# EAGLE design db9breakout (EAGLE 7.7.0)
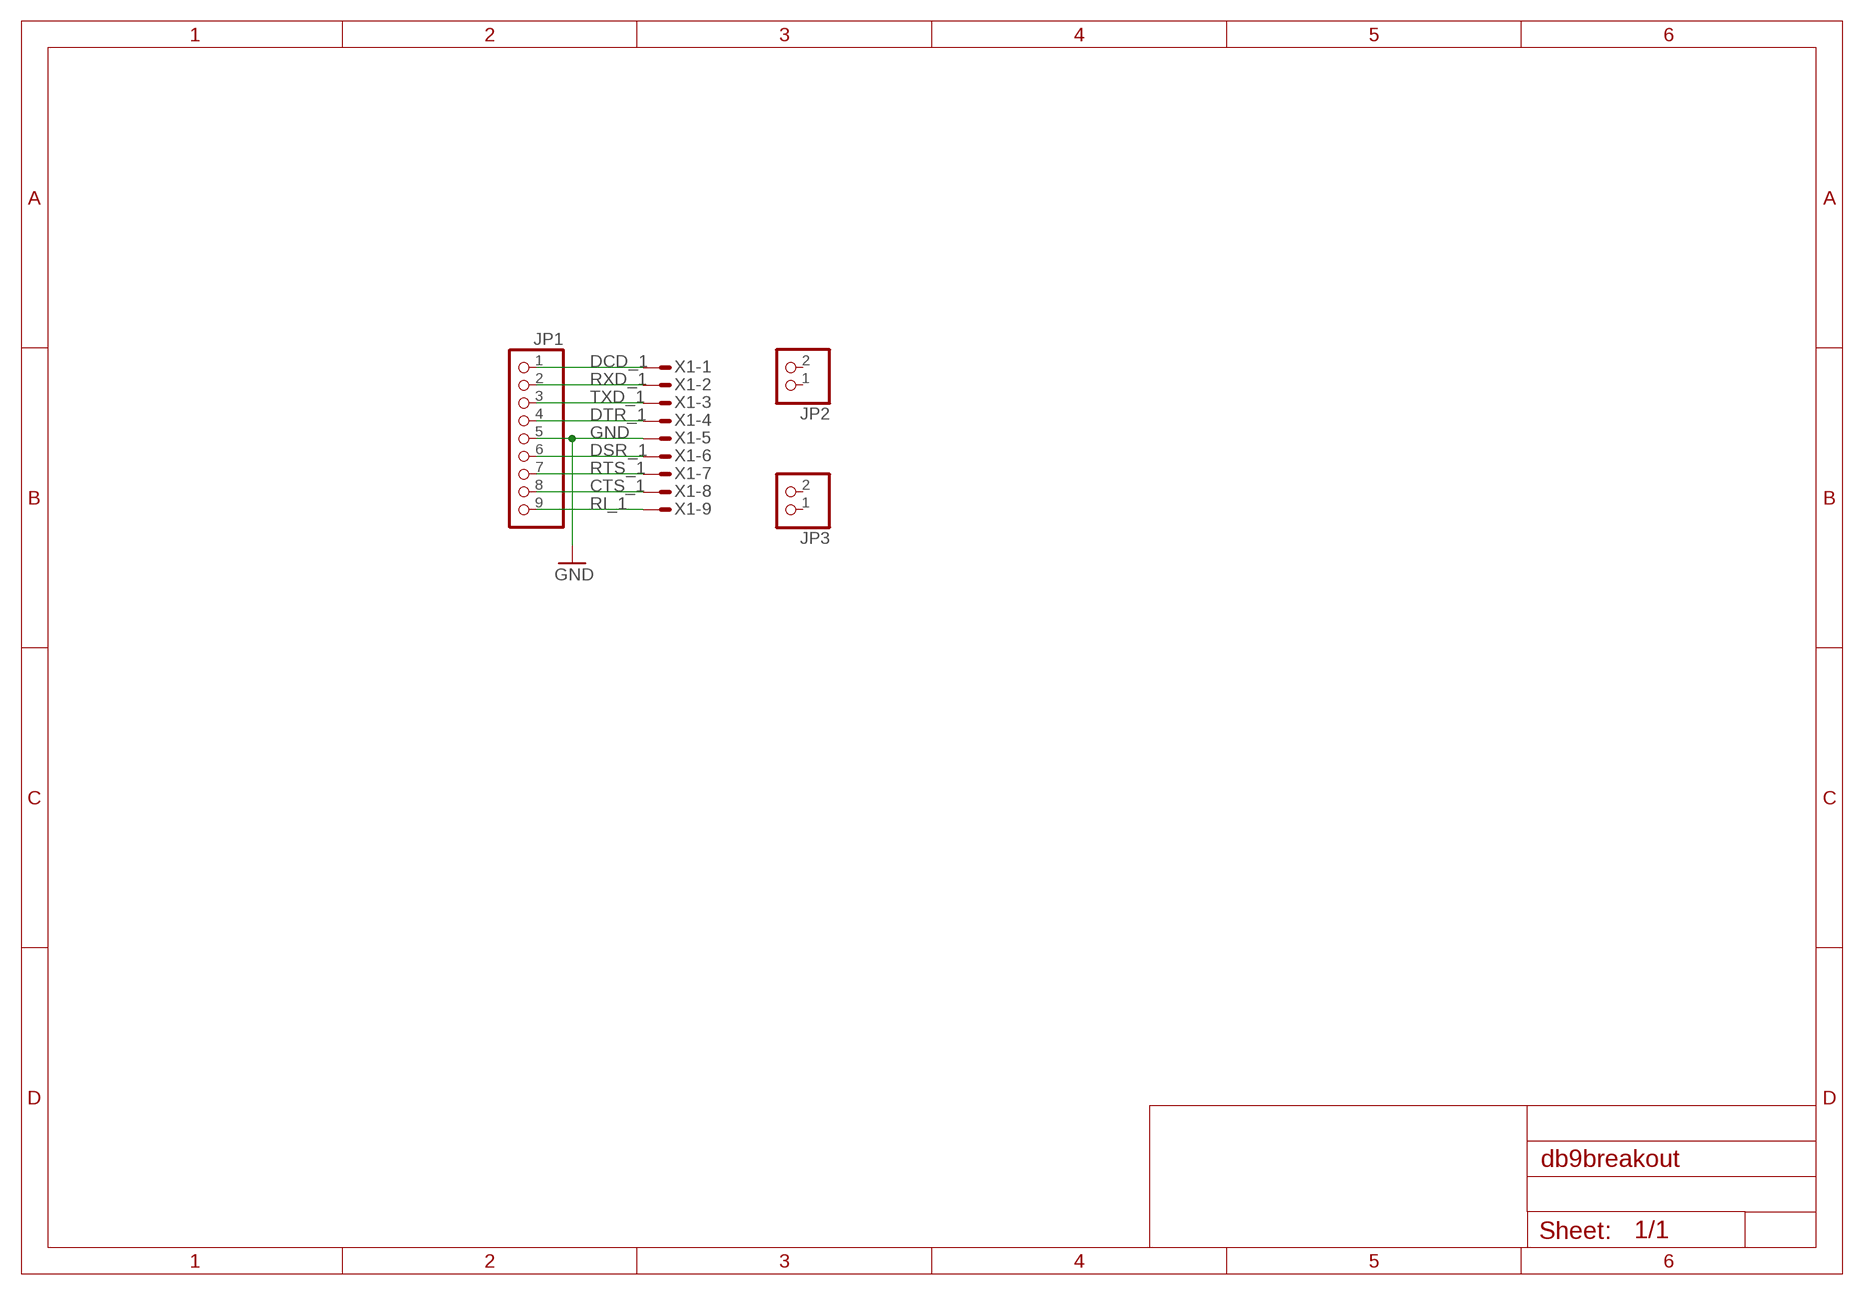
[diagram p0: schematic, sheet 1]

## Parts
JP1  PINHD-1X9  [1X09]
JP2  PINHD-1X2  [1X02]
JP3  PINHD-1X2  [1X02]
X1  M09HPS  [M09HP]

## Nets
CTS_1: JP1.8 X1.8
DCD_1: JP1.1 X1.1
DSR_1: JP1.6 X1.6
DTR_1: JP1.4 X1.4
GND: JP1.5 X1.5
RI_1: JP1.9 X1.9
RTS_1: JP1.7 X1.7
RXD_1: JP1.2 X1.2
TXD_1: JP1.3 X1.3
Unconnected: JP2.1 JP2.2 JP3.1 JP3.2

## Library data of the parts
JP1 = pinhead:PINHD-1X9: PIN HEADER
JP2 JP3 = pinhead:PINHD-1X2: PIN HEADER
X1 = con-subd:M09?S: SUB-D; OC_FARNELL: unknown; OC_NEWARK: unknown

## Net classes
0 default: width 0.406 mm, clearance 0.203 mm

## Board
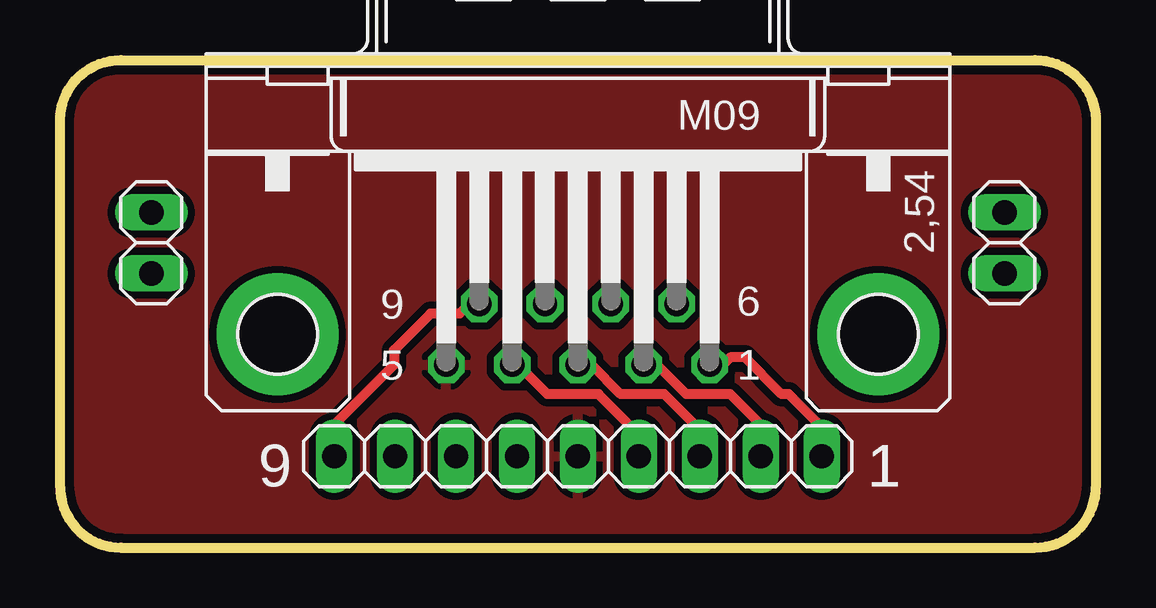
[diagram p1: board, top side]
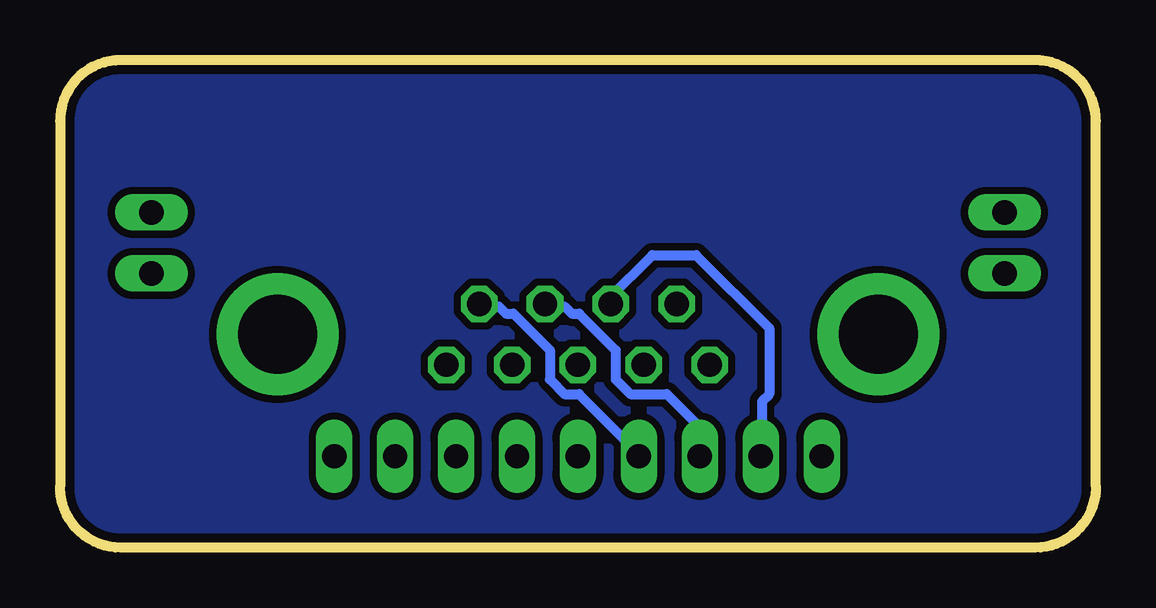
[diagram p2: board, bottom side, seen from below]

Size 43.18 x 20.32 mm. Coordinates in mm from the lower left corner, seen from the top.
Outline: 0,2.54 0,17.78 arc-90 2.54,20.32 40.64,20.32 arc-90 43.18,17.78 43.18,2.54 arc-90 40.64,0 2.54,0 arc-90 0,2.54
Copper layers (1*16): Top 0.0356mm / dielectric 1.5011mm / Bottom 0.0356mm
Design rules "oshpark-2layer": minimum track width 6mil, minimum drill 13mil, track to track 6mil, track to pad 6mil, pad to pad 6mil, via to via 6mil, smd to smd 6mil, copper to edge 15mil, drill to drill 6mil, minimum pad ring 7mil, minimum via ring 7mil, stop-mask expansion 2.5mil, vias tented up to drill 0mil, thermal gap 10mil

### Footprints (pad centres in the part's own frame; a part is rotated, then mirrored left to right if it is on the bottom)
1X09 = drill 1.016 long: 1 -10.16,0; 2 -7.62,0; 3 -5.08,0; 4 -2.54,0; 5 0,0; 6 2.54,0; 7 5.08,0; 8 7.62,0; 9 10.16,0
1X02 = drill 1.016 long: 1 -1.27,0; 2 1.27,0
M09HP = drill 1.016 octagon: 1 -5.486,1.27; 2 -2.743,1.27; 3 0,1.27; 4 2.743,1.27; 5 5.486,1.27; 6 -4.115,-1.27; 7 -1.372,-1.27; 8 1.372,-1.27; 9 4.115,-1.27 | drill 3.302 pad 5.08: G1 -12.522,0; G2 12.522,0

### Placement (x,y rotation side)
JP1  21.59,3.81 180 top
JP2  3.81,12.7 90 top
JP3  39.37,12.7 90 top
X1  21.59,8.89 180 top

### Tracks (layer width: path | path; a pad name or v marks a point on that pad's centre or on a via)
CTS_1
  Bottom 0.406: JP1.8 13.92,3.96 13.92,6.1 13.61,6.4 13.61,9.14 16.66,12.19 18.49,12.19 20.32,10.36 X1.8
DCD_1
  Top 0.406: X1.1 27.64,7.62 27.94,7.92 28.55,7.92 30.07,6.4 30.38,6.4 31.6,5.18 31.6,3.96 JP1.1
DSR_1
  Bottom 0.406: JP1.6 19.1,3.96 21.54,6.4 22.15,6.4 22.76,7.01 22.76,8.23 24.28,9.75 24.59,9.75 24.89,10.06 25.5,10.06 X1.6
DTR_1
  Top 0.406: X1.4 19.1,7.62 20.32,6.4 22.45,6.4 23.98,4.88 23.98,3.96 JP1.4
GND
  pour Top (isolate 0.305): 2.54,20.32 40.64,20.32 arc-90 43.18,17.78 43.18,2.54 arc-90 40.64,0 2.54,0 arc-90 0,2.54 0,17.78 arc-90
N$1
  pour Bottom (isolate 0.305): 2.54,20.32 40.64,20.32 arc-90 43.18,17.78 43.18,2.54 arc-90 40.64,0 2.54,0 arc-90 0,2.54 0,17.78 arc-90
RI_1
  Top 0.406: JP1.9 11.48,3.96 11.48,5.18 13.92,7.62 13.92,8.23 15.44,9.75 16.66,9.75 17.27,10.36 X1.9
RTS_1
  Bottom 0.406: JP1.7 16.66,3.96 16.66,5.18 17.88,6.4 19.41,6.4 20.02,7.01 20.02,8.23 21.54,9.75 21.84,9.75 22.15,10.06 22.76,10.06 X1.7
RXD_1
  Top 0.406: X1.2 24.89,7.62 26.11,6.4 27.94,6.4 29.16,5.18 29.16,3.96 JP1.2
TXD_1
  Top 0.406: X1.3 22.15,7.62 23.37,6.4 25.2,6.4 26.42,5.18 26.42,3.96 JP1.3

### Text on the board
tNames: 9 | 1 | 1